# Altium schematic sheet AdaptacionFuente.SchDoc
size A4
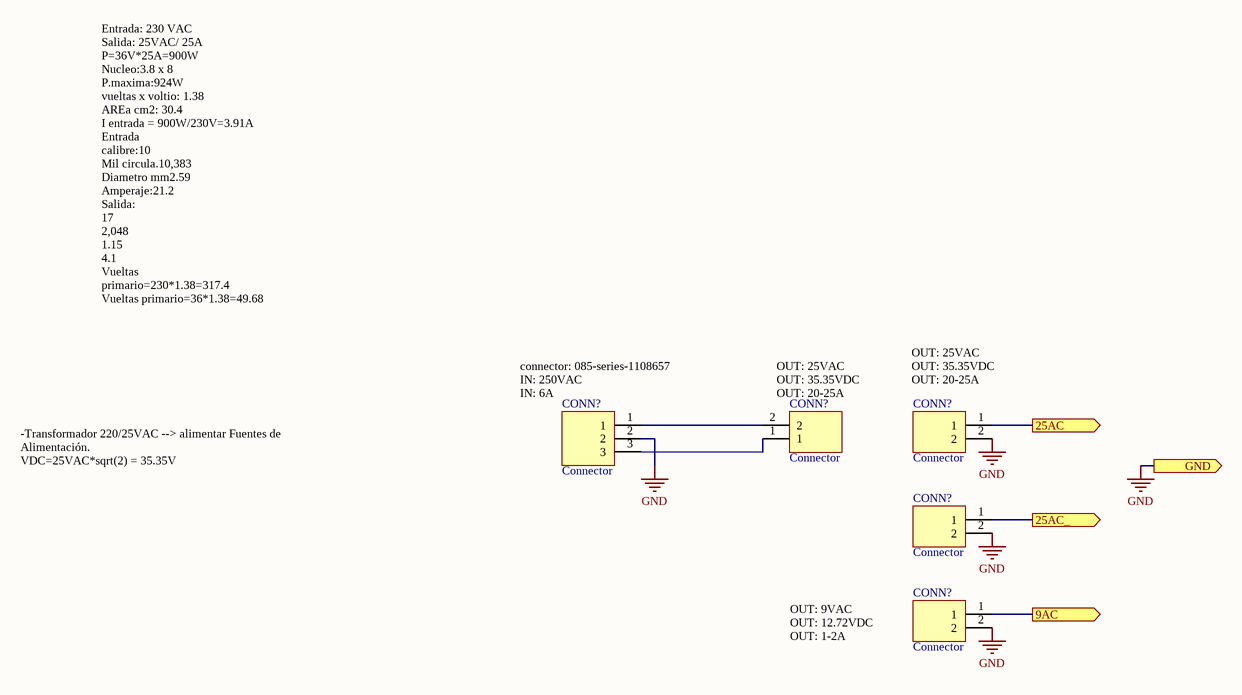
[diagram p0: AdaptacionFuente.SchDoc]

## Parts
(Parts that share a designator on the sheet are numbered #1, #2 ... from top to bottom, then left to right.)
CONN?#1  Connector  [1x2x2.54 Pin Header TH V]
CONN?#2  Connector  [1x2x2.54 Pin Header TH V]
CONN?#3  Connector  [1x3x2.54 Pin Header TH V]
CONN?#4  Connector  [1x2x2.54 Pin Header TH V]
CONN?#5  Connector  [1x2x2.54 Pin Header TH V]

## Ports
9AC (out), 25AC (out), 25AC_ (out), GND (out)

## Nets
GND: CONN?#2.2 CONN?#3.2 CONN?#4.2 CONN?#5.2 ; port GND
9AC: CONN?#5.1 ; port 9AC
25AC: CONN?#2.1 ; port 25AC
25AC_: CONN?#4.1 ; port 25AC_
NetCONN?#1_1: CONN?#1.1 CONN?#3.3
NetCONN?#1_2: CONN?#1.2 CONN?#3.1

## Notes on the sheet
- Entrada: 230 VAC
  Salida: 25VAC/ 25A
  P=36V*25A=900W
  Nucleo:3.8 x 8
  P.maxima:924W
  vueltas x voltio: 1.38
  AREa cm2: 30.4
  I entrada = 900W/230V=3.91A
  Entrada
  calibre:10
  Mil circula.10,383
  Diametro mm2.59
  Amperaje:21.2
  Salida:
  17
  2,048
  1.15
  4.1
  Vueltas primario=230*1.38=317.4
  Vueltas primario=36*1.38=49.68
- (near CONN?#3) connector: 085-series-1108657
  IN: 250VAC
  IN: 6A
- (near CONN?#1) OUT: 25VAC
  OUT: 35.35VDC
  OUT: 20-25A
- (near CONN?#2) OUT: 25VAC
  OUT: 35.35VDC
  OUT: 20-25A
- -Transformador 220/25VAC --> alimentar Fuentes de Alimentación.
  VDC=25VAC*sqrt(2) = 35.35V
- OUT: 9VAC
  OUT: 12.72VDC
  OUT: 1-2A

## Library data of the parts
CONN?#1 CONN?#2 CONN?#4 CONN?#5 = Header 1x2
CONN?#3 = Header 1x3